# EAGLE design NusbioMCU (EAGLE 7.6.0)
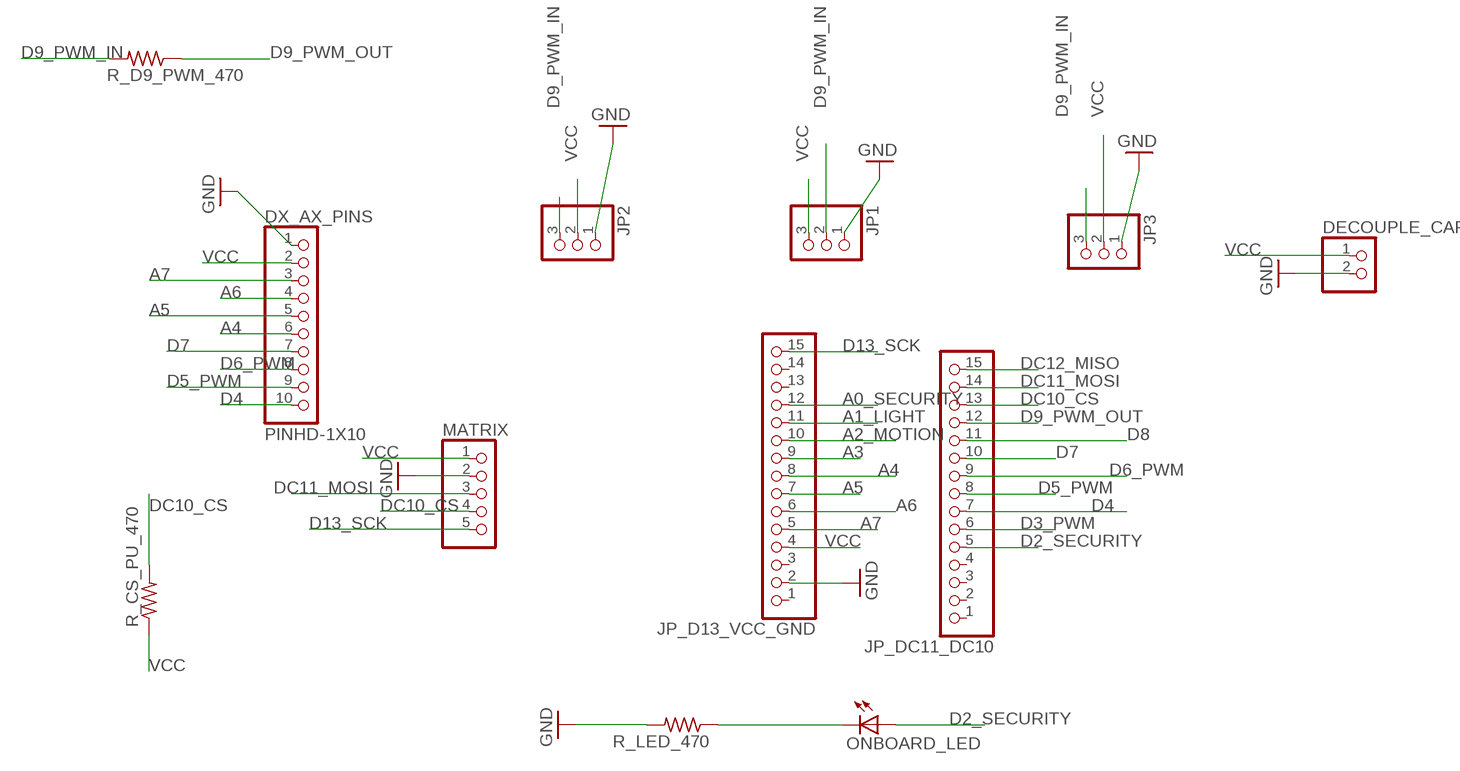
[diagram p0: schematic, sheet 1]

## Parts
DECOUPLE_CAP  PINHD-1X2  [1X02]
DX_AX_PINS  PINHD-1X10  [1X10-BIG]
JP1  PINHD-1X3  [1X03]
JP2  PINHD-1X3  [1X03]
JP3  PINHD-1X3  [1X03]
JP_D13_VCC_GND  PINHD-1X15  [1X15]
JP_DC11_DC10  PINHD-1X15  [1X15]
MATRIX  PINHD-1X5  [1X05]
ONBOARD_LED  LEDSMT1206  [1206]
R_CS_PU_470  R-US_R1206  [R1206]
R_D9_PWM_470  R-US_R1206  [R1206]
R_LED_470  R-US_R1206  [R1206]

## Nets
A0_SECURITY: JP_D13_VCC_GND.12
A1_LIGHT: JP_D13_VCC_GND.11
A2_MOTION: JP_D13_VCC_GND.10
A3: JP_D13_VCC_GND.9
A4: DX_AX_PINS.6 JP_D13_VCC_GND.8
A5: DX_AX_PINS.5 JP_D13_VCC_GND.7
A6: DX_AX_PINS.4 JP_D13_VCC_GND.6
A7: DX_AX_PINS.3 JP_D13_VCC_GND.5
D2_SECURITY: JP_DC11_DC10.5 ONBOARD_LED.A
D3_PWM: JP_DC11_DC10.6
D4: DX_AX_PINS.10 JP_DC11_DC10.7
D5_PWM: DX_AX_PINS.9 JP_DC11_DC10.8
D6_PWM: DX_AX_PINS.8 JP_DC11_DC10.9
D7: DX_AX_PINS.7 JP_DC11_DC10.10
D8: JP_DC11_DC10.11
D9_PWM_IN: JP1.2 JP2.3 JP3.3 R_D9_PWM_470.2
D9_PWM_OUT: JP_DC11_DC10.12 R_D9_PWM_470.1
D13_SCK: JP_D13_VCC_GND.15 MATRIX.5
DC10_CS: JP_DC11_DC10.13 MATRIX.4 R_CS_PU_470.2
DC11_MOSI: JP_DC11_DC10.14 MATRIX.3
DC12_MISO: JP_DC11_DC10.15
GND: DECOUPLE_CAP.2 DX_AX_PINS.1 JP1.1 JP2.1 JP3.1 JP_D13_VCC_GND.2 MATRIX.2 R_LED_470.2
N$1: ONBOARD_LED.C R_LED_470.1
VCC: DECOUPLE_CAP.1 DX_AX_PINS.2 JP1.3 JP2.2 JP3.2 JP_D13_VCC_GND.4 MATRIX.1 R_CS_PU_470.1
Unconnected: JP_D13_VCC_GND.1 JP_D13_VCC_GND.3 JP_D13_VCC_GND.13 JP_D13_VCC_GND.14 JP_DC11_DC10.1 JP_DC11_DC10.2 JP_DC11_DC10.3 JP_DC11_DC10.4

## Library data of the parts
DECOUPLE_CAP = pinhead:PINHD-1X2: PIN HEADER
DX_AX_PINS = adafruit:PINHD-1X10: Pin header 1x10 0.1" spacing With round pins
JP1-JP3 = adafruit:PINHD-1X3: PIN HEADER
JP_D13_VCC_GND JP_DC11_DC10 = adafruit:PINHD-1X15: PIN HEADER
MATRIX = pinhead:PINHD-1X5: PIN HEADER
ONBOARD_LED = adafruit:LED: LED OSRAM: - CHIPLED LG R971, LG N971, LY N971, LG Q971, LY Q971, LO R971, LY R971 LH N974, LH R974 LS Q976, LO Q976, LY Q976 LO Q996 - Hyper CHIPLED LW Q18S LB Q993, LB Q99A, LB R99A - SideLED LS A670, LO A670, LY A670, LG A670, LP A670 LB A673, LV A673, LT A673, LW A673 LH A674 LY A675 LS A676, LA A676, LO A676, LY A676, LW A676 LS A679, LY A679, LG A679 - Hyper Micro SIDELED® LS Y876, LA Y876, LO Y876, LY Y876 LT Y87S - SmartLED LW L88C, LW L88S LB L89C, LB L89S, LG L890 LS L89K, LO L89K, LY L89K LS L896, LA L896, LO L896, LY L896 - TOPLED LS T670, LO T670, LY T670, LG T670, LP T670 LSG T670, LSP T670, LSY T670, LOP T670, LYG T670 LG T671, LOG T671, LSG T671 LB T673, LV T673, LT T673, LW T673 LH T674 LS T676, LA T676, LO T676, LY T676, LB T676, LH T676, LSB T676, LW T676 LB T67C, LV T67C, LT T67C, LS T67K, LO T67K, LY T67K, LW E67C LS E67B, LA E67B, LO E67B, LY E67B, LB E67C, LV E67C, LT E67C LW T67C LS T679, LY T679, LG T679 LS T770, LO T770, LY T770, LG T770, LP T770 LB T773, LV T773, LT T773, LW T773 LH T774 LS E675, LA E675, LY E675, LS T675 LS T776, LA T776, LO T776, LY T776, LB T776 LHGB T686 LT T68C, LB T68C - Hyper Mini TOPLED® LB M676 - Mini TOPLED Santana® LG M470 LS M47K, LO M47K, LY M47K Source: http://www.osram.convergy.de/
R_CS_PU_470 R_D9_PWM_470 R_LED_470 = adafruit:R-US_: RESISTOR, American symbol

## Board
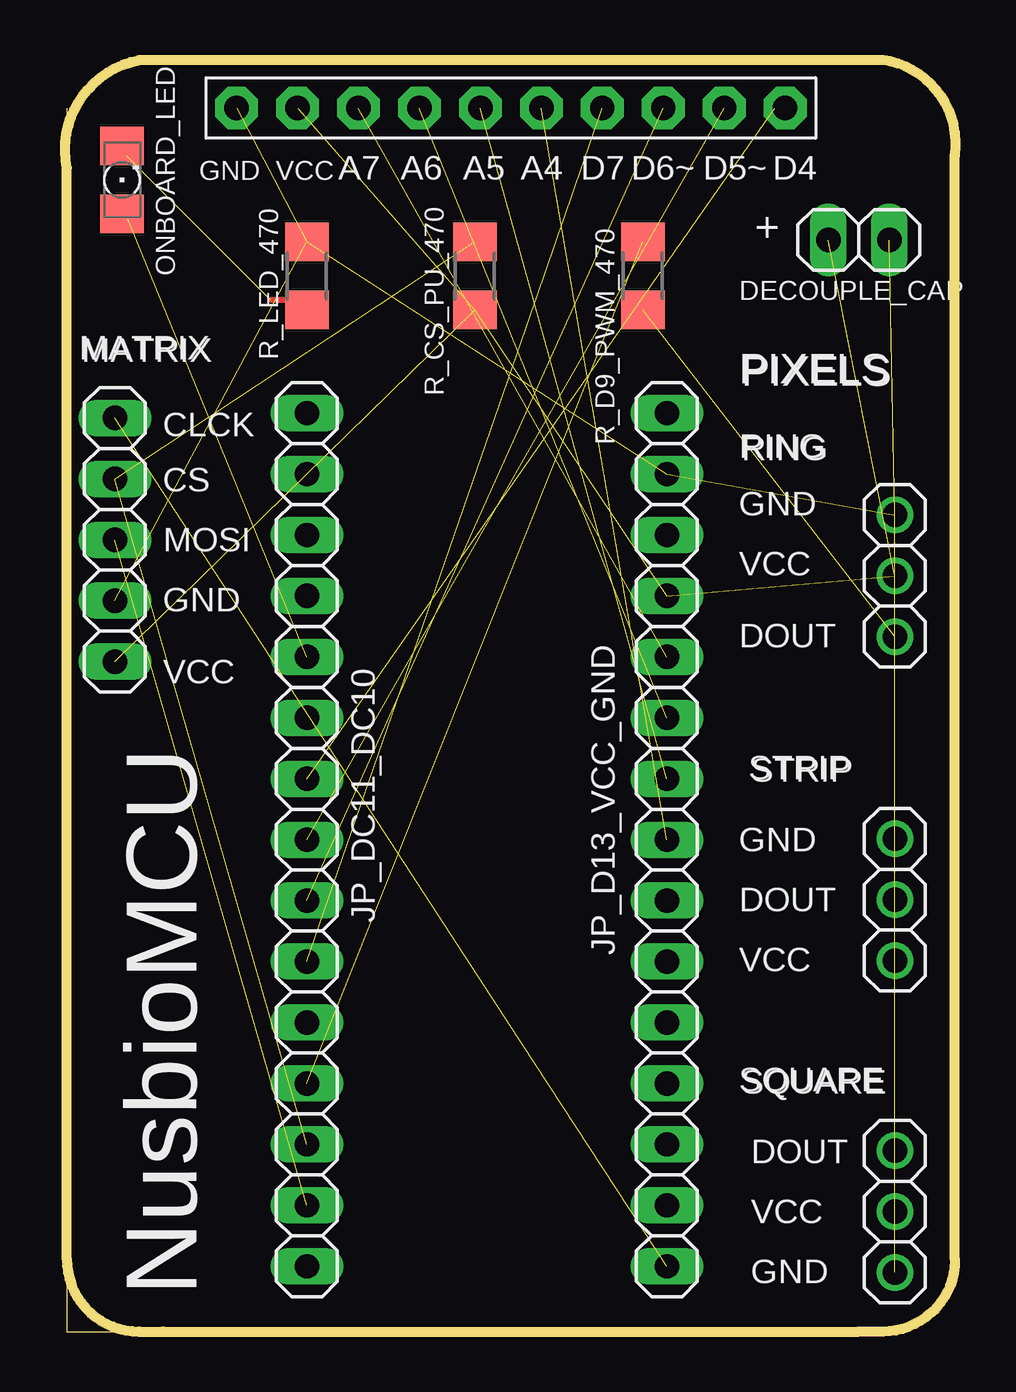
[diagram p1: board, top side]
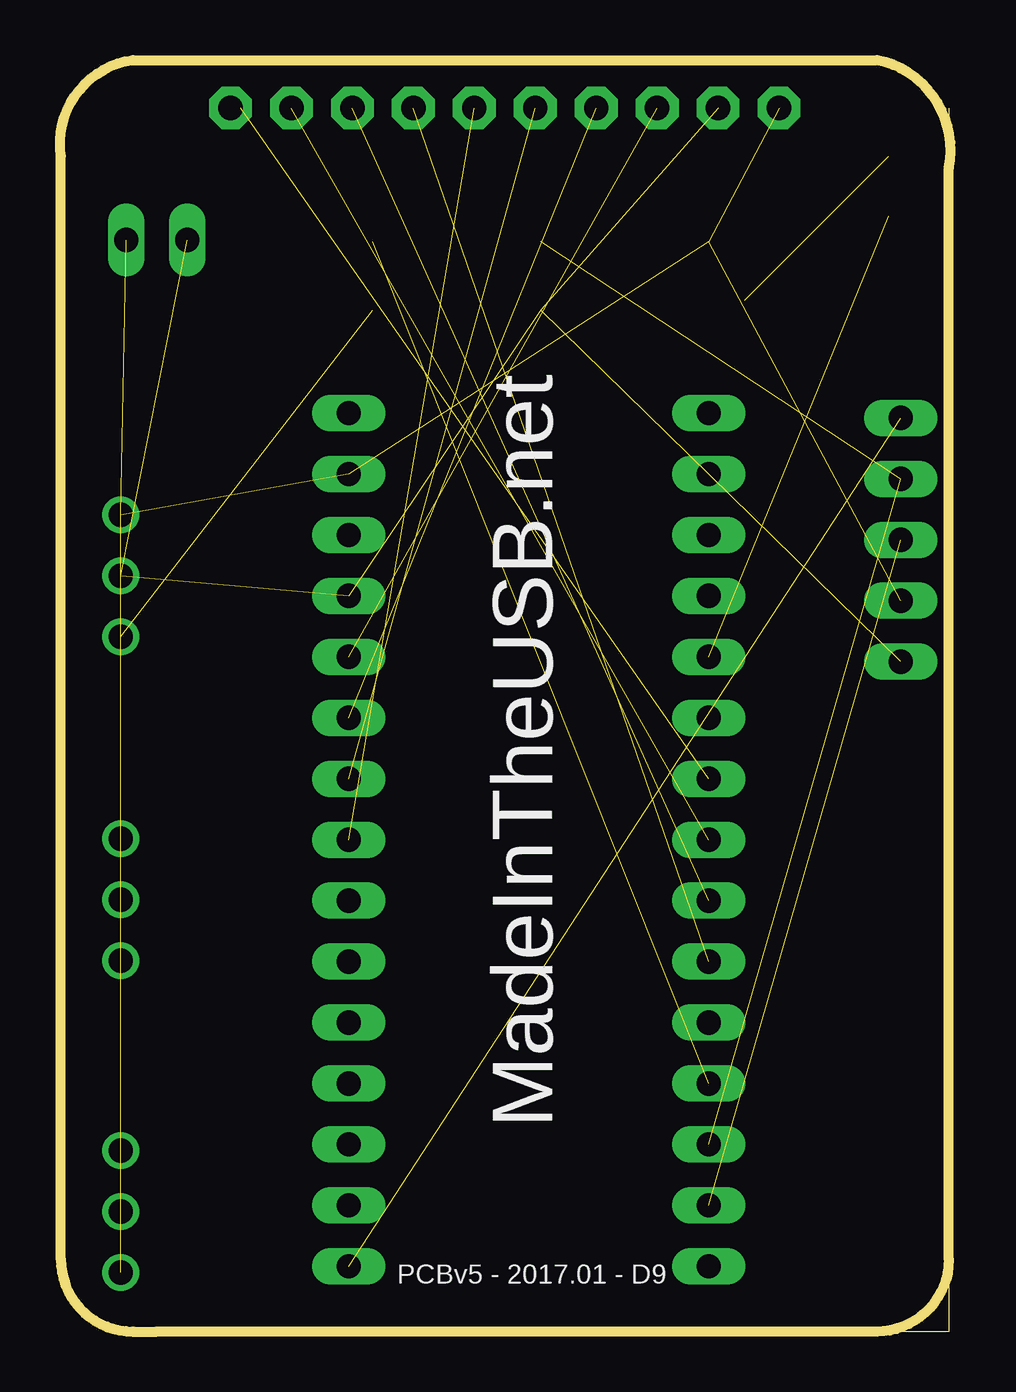
[diagram p2: board, bottom side, seen from below]

Size 37.11 x 53 mm. Coordinates in mm from the lower left corner, seen from the top.
Outline: 4.07,0 0.07,0 0.07,3
Outline: 24.07,0 33.07,0
Outline: 33.07,0 35.07,0
Outline: 0.07,51 0.07,48.5
Outline: 0.07,48.5 0.07,42
Outline: 0.07,3 arc90 3.07,0 4.07,0
Outline: 4.07,0 33.07,0
Outline: 33.07,0 34.07,0 arc90 37.07,3 37.07,49 arc90 34.07,53 3.07,53 arc90 0.07,48.5
Outline: 0.07,3 0.07,48.5
Copper layers (1*16): Top 0.035mm / dielectric 1.5mm / Bottom 0.035mm
Design rules "default": minimum track width 10mil, minimum drill 24mil, track to track 8mil, track to pad 8mil, pad to pad 8mil, via to via 8mil, smd to smd 8mil, copper to edge 40mil, drill to drill 8mil, minimum pad ring 10mil, minimum via ring 8mil, stop-mask expansion 4mil, vias tented up to drill 0mil, thermal gap 10mil

### Footprints (pad centres in the part's own frame; a part is rotated, then mirrored left to right if it is on the bottom)
1X02 = drill 1.016 long: 1 -1.27,0; 2 1.27,0
1X10-BIG = drill 1.016 pad 1.778 octagon: 1 -11.43,0; 2 -8.89,0; 3 -6.35,0; 4 -3.81,0; 5 -1.27,0; 6 1.27,0; 7 3.81,0; 8 6.35,0; 9 8.89,0; 10 11.43,0
1X03 = drill 1.016: 1 -2.54,0; 2 0,0; 3 2.54,0
1X15 = drill 1.016 long: 1 -17.78,0; 2 -15.24,0; 3 -12.7,0; 4 -10.16,0; 5 -7.62,0; 6 -5.08,0; 7 -2.54,0; 8 0,0; 9 2.54,0; 10 5.08,0; 11 7.62,0; 12 10.16,0; 13 12.7,0; 14 15.24,0; 15 17.78,0
1X05 = drill 1.016 long: 1 -5.08,0; 2 -2.54,0; 3 0,0; 4 2.54,0; 5 5.08,0
1206 = smd 1.6 x 1.803: A -1.422,0; C 1.422,0
R1206 = smd 1.6 x 1.803: 1 -1.422,0; 2 1.422,0

### Placement (x,y rotation side)
DECOUPLE_CAP  33.07,45.5 0 top
DX_AX_PINS  18.57,51 0 top
JP1  34.57,18 270 top
JP2  34.57,5 90 top
JP3  34.57,31.5 270 top
JP_D13_VCC_GND  25.07,20.5 270 top
JP_DC11_DC10  10.07,20.5 270 top
MATRIX  2.07,33 90 top
ONBOARD_LED  2.37,48 90 top
R_CS_PU_470  17.07,44 90 top
R_D9_PWM_470  24.07,44 270 top
R_LED_470  10.07,44 90 top

### Tracks (layer width: path | path; a pad name or v marks a point on that pad's centre or on a via)
A4  (1 unrouted)
A5  (1 unrouted)
A6  (1 unrouted)
A7  (1 unrouted)
D2_SECURITY  (1 unrouted)
  Top 0.254: 2.57,46.5 ONBOARD_LED.A
D4  (1 unrouted)
  Bottom 0.254: 29.57,51 DX_AX_PINS.10
D5_PWM  (1 unrouted)
D6_PWM  (1 unrouted)
D7  (1 unrouted)
D9_PWM_IN  (3 unrouted)
D9_PWM_OUT  (1 unrouted)
D13_SCK  (1 unrouted)
DC10_CS  (2 unrouted)
DC11_MOSI  (1 unrouted)
GND  (7 unrouted)
  Bottom 0.254: 7.07,51 DX_AX_PINS.1
N$1  (1 unrouted)
  Top 0.254: 8.57,43 10.07,43 R_LED_470.1 | 2.57,49 ONBOARD_LED.C
VCC  (7 unrouted)

### Text on the board
tNames: GND | VCC | A7 | A6 | A5 | A4 | D7 | D6~ | D5~ | D4 | + | MATRIX | MATRIX | PIXELS | PIXELS | CLCK | RING | RING | CS | GND | MOSI | VCC | GND | DOUT | VCC | STRIP | STRIP | GND | DOUT | VCC | SQUARE | SQUARE | DOUT | VCC | NusbioMCU | GND
bNames: MadeInTheUSB.net | PCBv5 - 2017.01 - D9